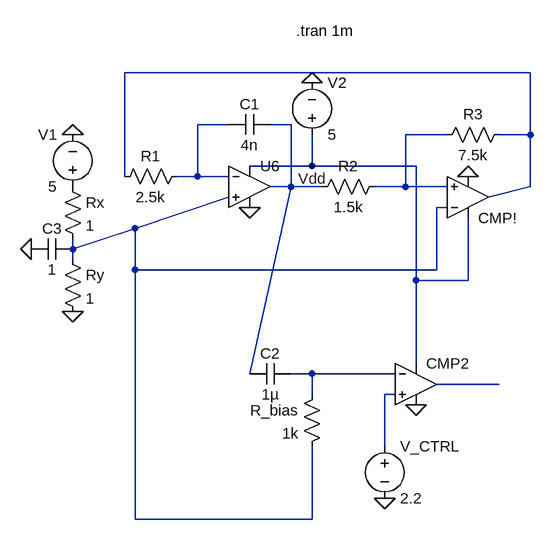
[diagram p0: schematic PWM.asc]
PWM.asc, the LTspice schematic file:
Version 4
SHEET 1 1540 1120
WIRE 768 48 144 48
WIRE 304 128 256 128
WIRE 400 128 368 128
WIRE 640 144 576 144
WIRE 768 144 768 48
WIRE 768 144 720 144
WIRE 432 192 432 144
WIRE 432 192 336 192
WIRE 592 192 432 192
WIRE 144 208 144 48
WIRE 256 208 256 128
WIRE 256 208 224 208
WIRE 304 208 256 208
WIRE 400 224 400 128
WIRE 400 224 368 224
WIRE 448 224 400 224
WIRE 576 224 576 144
WIRE 576 224 528 224
WIRE 640 224 576 224
WIRE 768 224 768 144
WIRE 704 240 768 224
WIRE 640 256 624 256
WIRE 160 288 304 240
WIRE 64 320 160 288
WIRE 64 320 64 304
WIRE 64 336 64 320
WIRE 160 352 160 288
WIRE 624 352 624 256
WIRE 624 352 160 352
WIRE 592 368 592 192
WIRE 672 368 672 272
WIRE 672 368 592 368
WIRE 592 496 592 368
WIRE 336 512 400 224
WIRE 432 512 400 512
WIRE 560 512 432 512
WIRE 720 528 624 528
WIRE 432 544 432 512
WIRE 560 544 544 544
WIRE 544 624 544 544
WIRE 160 736 160 352
WIRE 432 736 432 624
WIRE 432 736 160 736
FLAG 64 144 0
FLAG 64 416 0
FLAG 432 64 0
FLAG 336 256 0
FLAG 592 560 0
FLAG 544 704 0
FLAG 672 208 0
FLAG 0 320 0
FLAG 432 192 Vdd
SYMBOL voltage 64 240 R180
WINDOW 0 24 96 Left 2
WINDOW 3 24 16 Left 2
SYMATTR InstName V1
SYMATTR Value 5
SYMBOL res 48 208 R0
SYMATTR InstName Rx
SYMATTR Value 1
SYMBOL res 48 320 R0
SYMATTR InstName Ry
SYMATTR Value 1
SYMBOL res 240 192 R90
WINDOW 0 0 56 VBottom 2
WINDOW 3 32 56 VTop 2
SYMATTR InstName R1
SYMATTR Value 2.5k
SYMBOL res 544 208 R90
WINDOW 0 0 56 VBottom 2
WINDOW 3 32 56 VTop 2
SYMATTR InstName R2
SYMATTR Value 1.5k
SYMBOL res 736 128 R90
WINDOW 0 0 56 VBottom 2
WINDOW 3 32 56 VTop 2
SYMATTR InstName R3
SYMATTR Value 7.5k
SYMBOL cap 304 144 R270
WINDOW 0 32 32 VTop 2
WINDOW 3 0 32 VBottom 2
SYMATTR InstName C1
SYMATTR Value 4n
SYMBOL cap 400 496 R90
WINDOW 0 0 32 VBottom 2
WINDOW 3 32 32 VTop 2
SYMATTR InstName C2
SYMATTR Value 1µ
SYMBOL voltage 432 160 M180
WINDOW 0 24 96 Left 2
WINDOW 3 24 16 Left 2
SYMATTR InstName V2
SYMATTR Value 5
SYMBOL res 448 528 M0
SYMATTR InstName R_bias
SYMATTR Value 1k
SYMBOL UniversalOpamp2 672 240 M180
SYMATTR InstName CMP!
SYMBOL UniversalOpamp2 592 528 R0
SYMATTR InstName CMP2
SYMBOL UniversalOpamp2 336 224 R0
SYMATTR InstName U6
SYMBOL voltage 544 608 R0
SYMATTR InstName V_CTRL
SYMATTR Value 2.2
SYMBOL cap 0 336 R270
WINDOW 0 32 32 VTop 2
WINDOW 3 0 32 VBottom 2
SYMATTR InstName C3
SYMATTR Value 1
TEXT 408 -16 Left 2 !.tran 1m

The netlist it stands for:
* PWM.asc
V1 P001 0 5
Rx P001 N005 1
Ry N005 0 1
R1 N002 N001 2.5k
R2 N004 N003 1.5k
R3 N001 N004 7.5k
C1 N002 N003 4n
C2 N006 N003 1µ
V2 Vdd 0 5
R_bias N006 N005 1k
XCMP! N004 N005 Vdd 0 N001 level.2 Avol=1Meg GBW=10Meg Slew=10Meg ilimit=25m rail=0 Vos=0 phimargin=45 en=0 enk=0 in=0 ink=0 Rin=500Meg  ; pins IN+ IN- V+ V- OUT
XCMP2 N008 N006 Vdd 0 N007 level.2 Avol=1Meg GBW=10Meg Slew=10Meg ilimit=25m rail=0 Vos=0 phimargin=45 en=0 enk=0 in=0 ink=0 Rin=500Meg  ; pins IN+ IN- V+ V- OUT
XU6 N005 N002 Vdd 0 N003 level.2 Avol=1Meg GBW=10Meg Slew=10Meg ilimit=25m rail=0 Vos=0 phimargin=45 en=0 enk=0 in=0 ink=0 Rin=500Meg  ; pins IN+ IN- V+ V- OUT
V_CTRL N008 0 2.2
C3 0 N005 1
.tran 1m
.lib UniversalOpamps2.sub
.backanno
.end